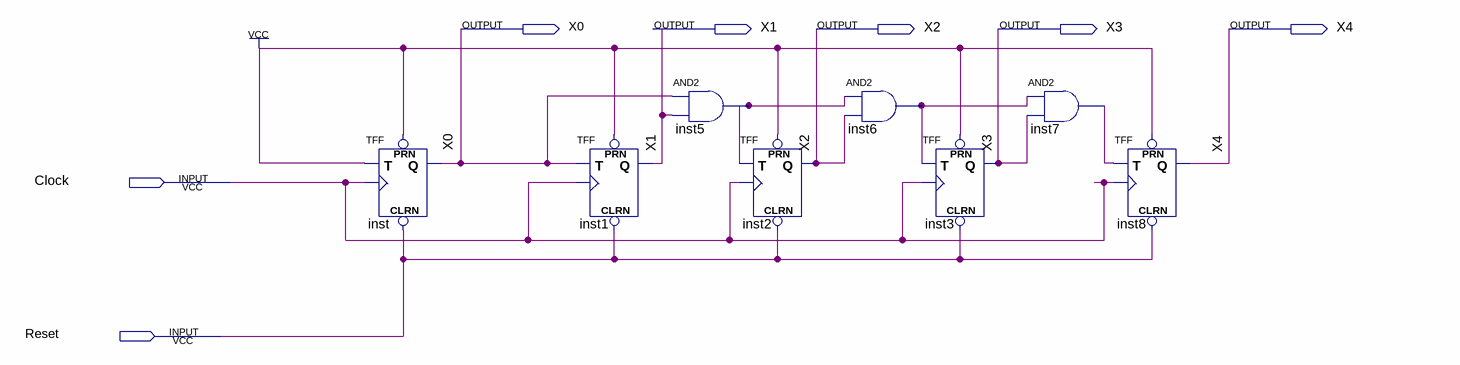
[diagram p0: schematic sheet]
// Quartus schematic Counter.bdf as structural Verilog: 8 symbols, 7 pins
module Counter (
  input  Clock,
  input  Reset,
  output X0,
  output X1,
  output X2,
  output X3,
  output X4
);

  wire inst5_out, inst6_out, inst7_out;

  TFF inst (.PRN(1'b1), .CLRN(Reset), .T(1'b1), .CLK(Clock), .Q(X0));
  TFF inst1 (.PRN(1'b1), .CLRN(Reset), .T(X0), .CLK(Clock), .Q(X1));
  and inst5 (inst5_out, X0, X1);
  TFF inst2 (.PRN(1'b1), .CLRN(Reset), .T(inst5_out), .CLK(Clock), .Q(X2));
  and inst6 (inst6_out, inst5_out, X2);
  TFF inst3 (.PRN(1'b1), .CLRN(Reset), .T(inst6_out), .CLK(Clock), .Q(X3));
  and inst7 (inst7_out, inst6_out, X3);
  TFF inst8 (.PRN(1'b1), .CLRN(Reset), .T(inst7_out), .CLK(Clock), .Q(X4));
endmodule
